# EAGLE design tick-mini-mk-1.0 (EAGLE 6.5.0)
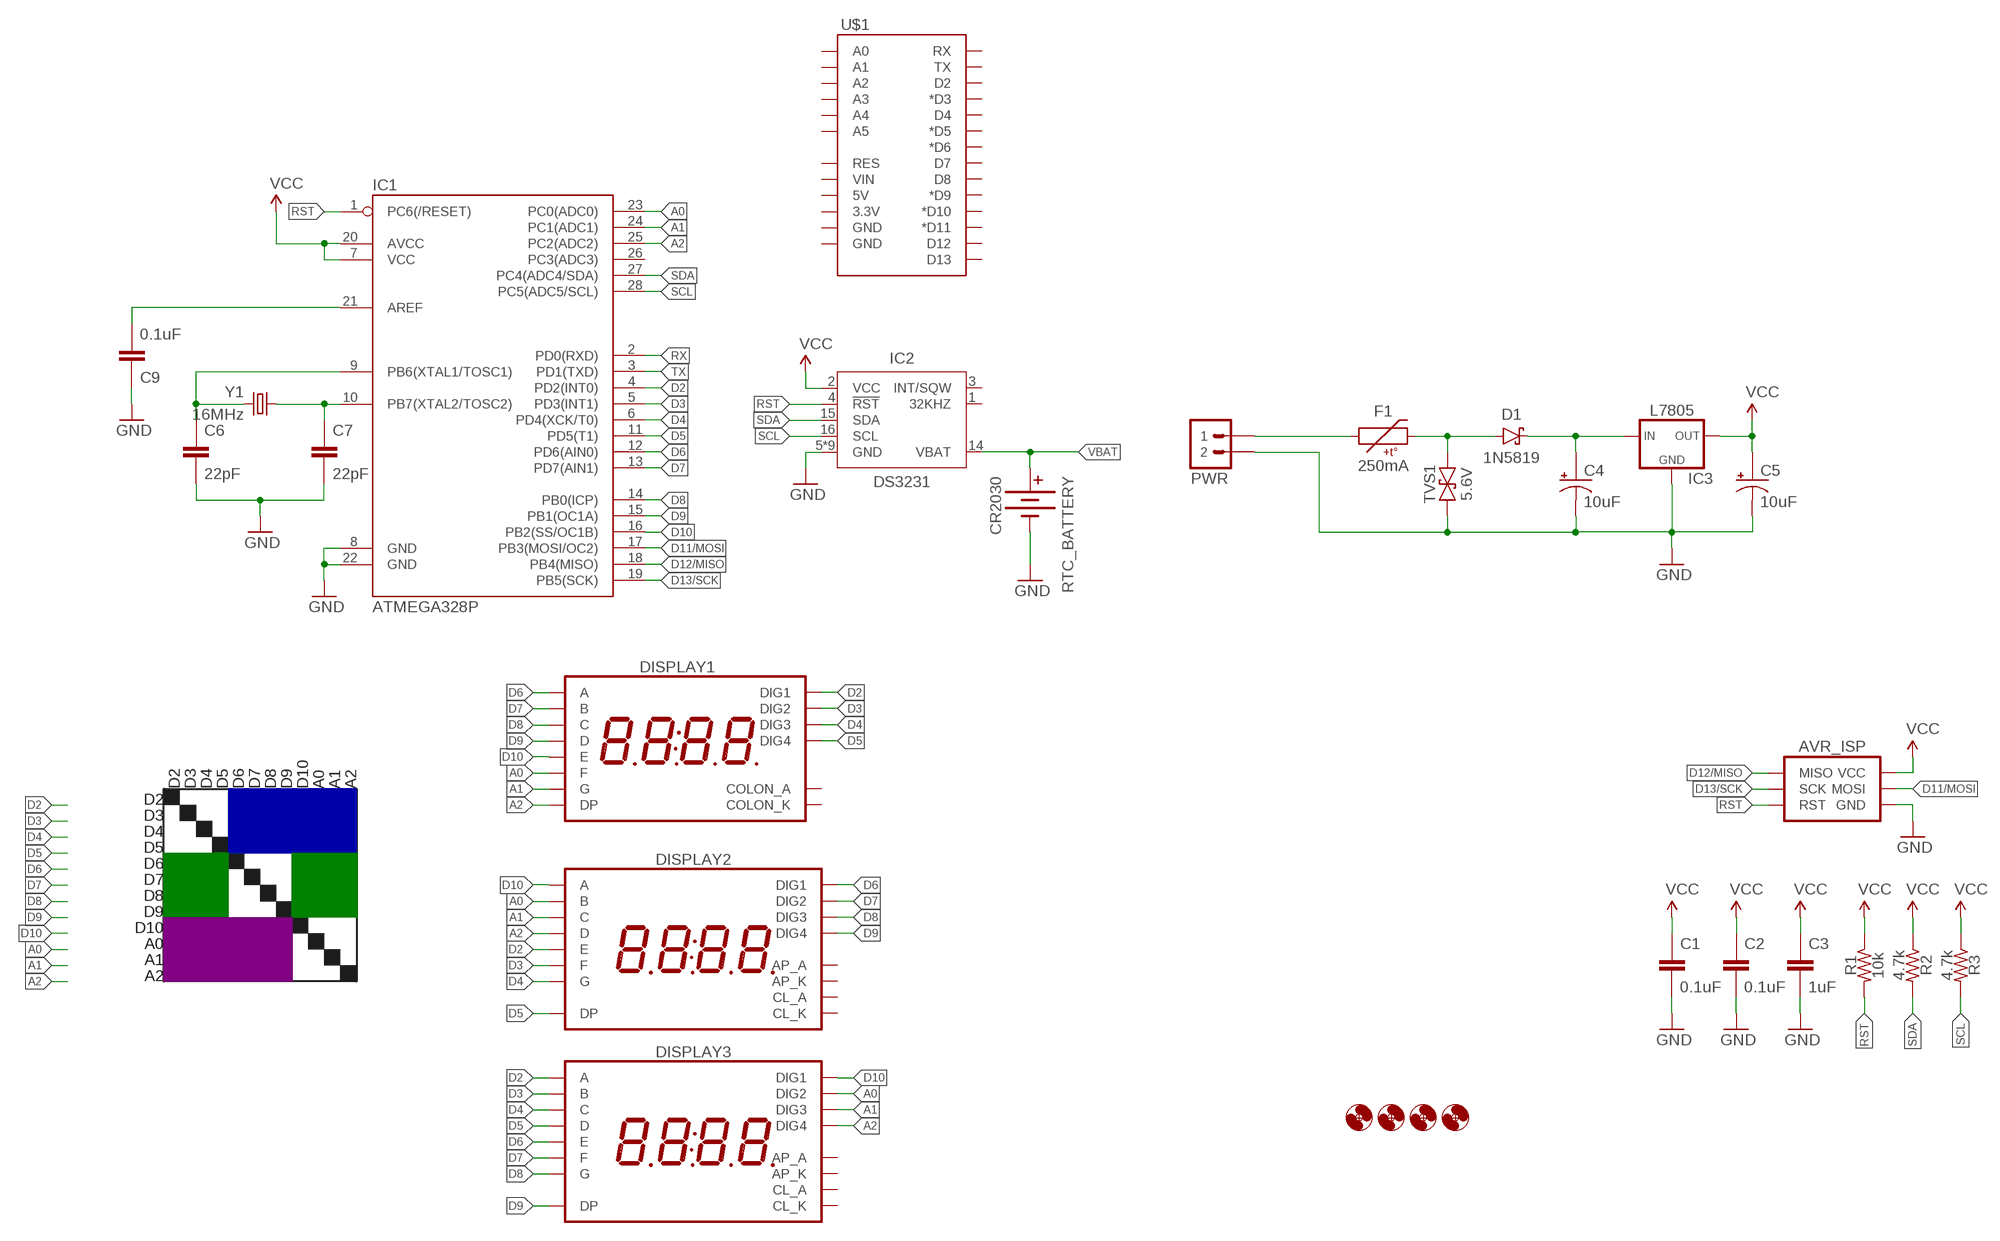
[diagram p0: schematic, sheet 1]

## Parts
AVR_ISP  AVR_SPI_PRG_6PTH  [2X3]
C1  0.1uF  CAPACITOR-CERAMIC025-024X044  [C025-024X044]
C2  0.1uF  CAPACITOR-CERAMIC025-024X044  [C025-024X044]
C3  1uF  CAPACITOR-CERAMIC025-024X044  [C025-024X044]
C4  10uF  CAPACITOR-POLARIZEDE2-5  [E2-5]
C5  10uF  CAPACITOR-POLARIZEDE2-5  [E2-5]
C6  22pF  CAPACITOR-CERAMIC025-024X044  [C025-024X044]
C7  22pF  CAPACITOR-CERAMIC025-024X044  [C025-024X044]
C9  0.1uF  CAPACITOR-CERAMIC025-024X044  [C025-024X044]
D1  1N5819  DIODE-SCHOTTKYPTH-10.16MM  [DIODE-10.16MM]
DISPLAY1  7SEG_4DIGIT_COLON14.2MM-CC  [7SEG_4DIG_0.56IN_14MM_ADAFRUIT]
DISPLAY2  7SEG_4DIGIT_COLON_APOS  [7SEG_4DIG_10MM]
DISPLAY3  7SEG_4DIGIT_COLON_APOS  [7SEG_4DIG_10MM]
F1  250mA  PTCPTH-5.08MM  [PTC-PTH-5.08MM]
H1  HOLE#2  [HOLE-#2]
H2  HOLE#2  [HOLE-#2]
H3  HOLE#2  [HOLE-#2]
H4  HOLE#2  [HOLE-#2]
IC1  ATMEGA328P  ATMEGA328P_PDIP  [DIL28-3]
IC2  DS3231  [SO16W]
IC3  L7805  V_REG_78XXTO-92-INLINE  [TO-92-AMMO]
PWR  M02JST-PTH-VERT  [JST-2-PH-VERT-PTH]
R1  10k  RESISTORPTH-AXIAL-7.62MM  [RESISTOR-AXIAL-PTH-7.62MM]
R2  4.7k  RESISTORPTH-AXIAL-6.35MM  [RESISTOR-AXIAL-PTH-6.35MM]
R3  4.7k  RESISTORPTH-AXIAL-6.35MM  [RESISTOR-AXIAL-PTH-6.35MM]
RTC_BATTERY  CR2030  BATTERY12MM  [BATTCON_12MM]
TVS1  5.6V  TVSDO-41-10.16MM  [DO-41-TVS-BI-10.16MM]
U$1  ARDUINO_SHIELD_SMALLER  [ARDUINO_SHIELD_NOOUTLINE_INSIDE_SMALLER]
Y1  16MHz  CRYSTALHC49UV  [HC49U-V]

## Nets
A0: DISPLAY1.P$12(F) DISPLAY2.16(B) DISPLAY3.2(DIG2) IC1.23(PC0(ADC0))
A1: DISPLAY1.P$5(G) DISPLAY2.13(C) DISPLAY3.6(DIG3) IC1.24(PC1(ADC1))
A2: DISPLAY1.P$3(DP) DISPLAY2.3(D) DISPLAY3.8(DIG4) IC1.25(PC2(ADC2))
D2: DISPLAY1.P$14(DIG1) DISPLAY2.5(E) DISPLAY3.14(A) IC1.4(PD2(INT0))
D3: DISPLAY1.P$11(DIG2) DISPLAY2.11(F) DISPLAY3.16(B) IC1.5(PD3(INT1))
D4: DISPLAY1.P$10(DIG3) DISPLAY2.15(G) DISPLAY3.13(C) IC1.6(PD4(XCK/T0))
D5: DISPLAY1.P$6(DIG4) DISPLAY2.7(DP) DISPLAY3.3(D) IC1.11(PD5(T1))
D6: DISPLAY1.P$13(A) DISPLAY2.1(DIG1) DISPLAY3.5(E) IC1.12(PD6(AIN0))
D7: DISPLAY1.P$9(B) DISPLAY2.2(DIG2) DISPLAY3.11(F) IC1.13(PD7(AIN1))
D8: DISPLAY1.P$4(C) DISPLAY2.6(DIG3) DISPLAY3.15(G) IC1.14(PB0(ICP))
D9: DISPLAY1.P$2(D) DISPLAY2.8(DIG4) DISPLAY3.7(DP) IC1.15(PB1(OC1A))
D10: DISPLAY1.P$1(E) DISPLAY2.14(A) DISPLAY3.1(DIG1) IC1.16(PB2(SS/OC1B))
D11/MOSI: AVR_ISP.4(MOSI) IC1.17(PB3(MOSI/OC2))
D12/MISO: AVR_ISP.1(MISO) IC1.18(PB4(MISO))
D13/SCK: AVR_ISP.3(SCK) IC1.19(PB5(SCK))
GND: AVR_ISP.6(GND) C1.2 C2.2 C3.2 C4.- C5.- C6.2 C7.2 C9.1 IC1.8(GND) IC1.22(GND) IC2.5(GND) IC2.6(GND) IC2.7(GND) IC2.8(GND) IC2.9(GND) IC2.10(GND) IC2.11(GND) IC2.12(GND) IC2.13(GND) IC3.2(GND) PWR.2 RTC_BATTERY.GND(-) TVS1.P$1
N$1: C9.2 IC1.21(AREF)
N$4: D1.A F1.P$2 TVS1.P$2
N$6: C6.1 IC1.9(PB6(XTAL1/TOSC1)) Y1.2
N$7: F1.P$1 PWR.1
N$8: C4.+ D1.C IC3.1(IN)
N$9: C7.1 IC1.10(PB7(XTAL2/TOSC2)) Y1.1
RST: AVR_ISP.5(RST) IC1.1(PC6(/RESET)) IC2.4(!RST) R1.P$2
RX: IC1.2(PD0(RXD))
SCL: IC1.28(PC5(ADC5/SCL)) IC2.16(SCL) R3.P$2
SDA: IC1.27(PC4(ADC4/SDA)) IC2.15(SDA) R2.P$2
TX: IC1.3(PD1(TXD))
VBAT: IC2.14(VBAT) RTC_BATTERY.PWR@1(+)
VCC: AVR_ISP.2(VCC) C1.1 C2.1 C3.1 C5.+ IC1.7(VCC) IC1.20(AVCC) IC2.2(VCC) IC3.3(OUT) R1.P$1 R2.P$1 R3.P$1
Unconnected: DISPLAY1.P$7(COLON_K) DISPLAY1.P$8(COLON_A) DISPLAY2.4(CL_A) DISPLAY2.9(AP_K) DISPLAY2.10(AP_A) DISPLAY2.12(CL_K) DISPLAY3.4(CL_A) DISPLAY3.9(AP_K) DISPLAY3.10(AP_A) DISPLAY3.12(CL_K) IC1.26(PC3(ADC3)) IC2.1(32KHZ) IC2.3(INT/SQW) U$1.3.3V U$1.5V U$1.A0 U$1.A1 U$1.A2 U$1.A3 U$1.A4 U$1.A5 U$1.D2 U$1.D3(*D3) U$1.D4 U$1.D5(*D5) U$1.D6(*D6) U$1.D7 U$1.D8 U$1.D9(*D9) U$1.D10(*D10) U$1.D11(*D11) U$1.D12 U$1.D13 U$1.GND@0(GND) U$1.GND@1(GND) U$1.RES U$1.RX U$1.TX U$1.VIN

## Notes on the sheet
- D2 | D3 | D4 | D5 | D6 | D7 | D8 | D9 | D10 | A0 | A1 | A2
- D2
- D3
- D4
- D5
- D6
- D7
- D8
- D9
- D10
- A0
- A1
- A2

## Library data of the parts
AVR_ISP = A_butts:AVR_SPI_PRG_6: AVR ISP 6 Pin This is the reduced ISP connector for AVR programming. Common on Arduino. This footprint will take up less PCB space and can be used with a 10-pin to 6-pin adapter such as SKU: BOB-08508 **Special note about "TEST_POINT" package. The stop mask is on the top side, so if you want your programming test points to be on the bottom of your board, make sure to place this package on the bottom side of the board. This also ensure that the orientation to program from the bottom side will be correct.
C1-C3 C6 C7 C9 = A_butts:CAPACITOR-CERAMIC: CAPACITOR, European symbol
C4 C5 = A_butts:CAPACITOR-POLARIZED: POLARIZED CAPACITOR, American symbol
D1 = A_butts:DIODE-SCHOTTKY: Schottky diodes in SFE's production catalog BAT20J 1A 23V 0.62Vf RB751 120mA 40V 0.37Vf PMEG4005EJ 0.5A 40V 0.42Vf MBRA140 1A 40V 0.5Vf B340A 3A 40V SMA
DISPLAY1 = A_butts:7SEG_4DIGIT_COLON
DISPLAY2 DISPLAY3 = A_butts:7SEG_4DIGIT_COLON_APOS
F1 = A_butts:PTC: Resettable Fuse PTC Resettable Fuse. Spark Fun Electronics SKU : COM-08357
H1-H4 = A_butts:HOLE: MOUNTING HOLE with drill center marker
IC1 = A_butts:ATMEGA328P_PDIP: uC used in the Arduino 32kb flash, 1k EEPROM, 2k SRAM This is the through-hole version of this chip.
IC2 = A_butts:DS3231
IC3 = A_butts:V_REG_78XX: Voltage Regulator Standard 7805 5V regulator. IGO (Input Ground Output). Spark Fun Electronics SKU : COM-00107
PWR = A_butts:M02: Standard 2-pin 0.1" header. Use with - straight break away headers ( PRT-00116) - right angle break away headers (PRT-00553) - swiss pins (PRT-00743) - machine pins (PRT-00117) - female headers (PRT-00115) Molex polarized connector foot print use with: PRT-08233 with associated crimp pins and housings. 2.54_SCREWTERM for use with PRT-10571. 3.5mm Screw Terminal footprints for PRT-08084 5mm Screw Terminal footprints for use with PRT-08433
R1-R3 = A_butts:RESISTOR: RESISTOR, American symbol
RTC_BATTERY = A_butts:BATTERY: Battery Holders Various common sizes : AA, AAA, 20mm coin cell and 12mm coin cell. 20MM_4LEGS, BATT-10373
TVS1 = A_butts:TVS: Transient voltage suppressor- prevents ESD on inputs. Ignore package description- MBRA140 is NOT this type of part!!!
U$1 = A_butts:ARDUINO_SHIELD_SMALLER
Y1 = A_butts:CRYSTAL: Various standard crystals. Proven footprints. Spark Fun Electronics SKU : COM-00534

## Board
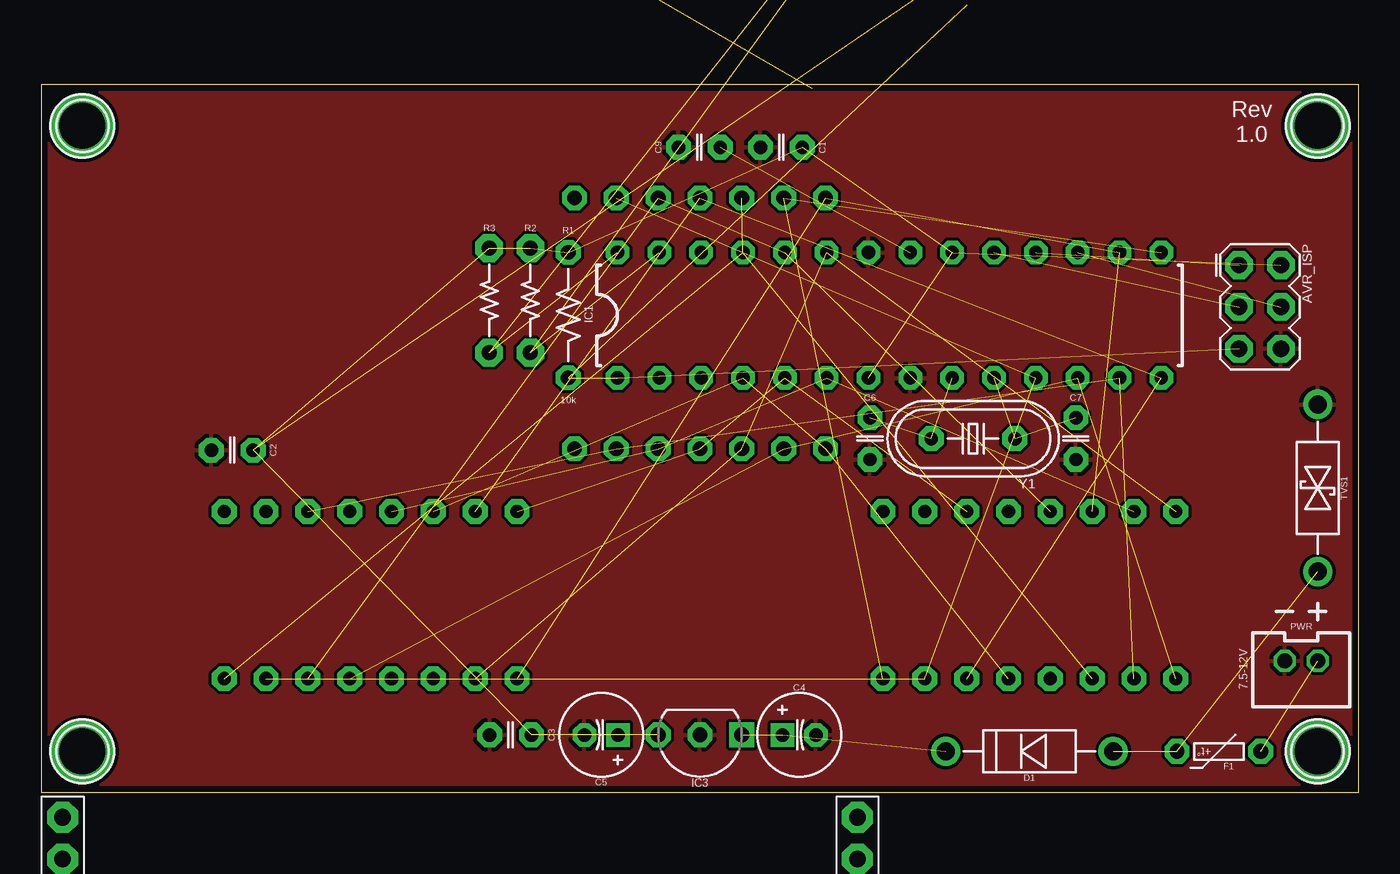
[diagram p1: board, top side]
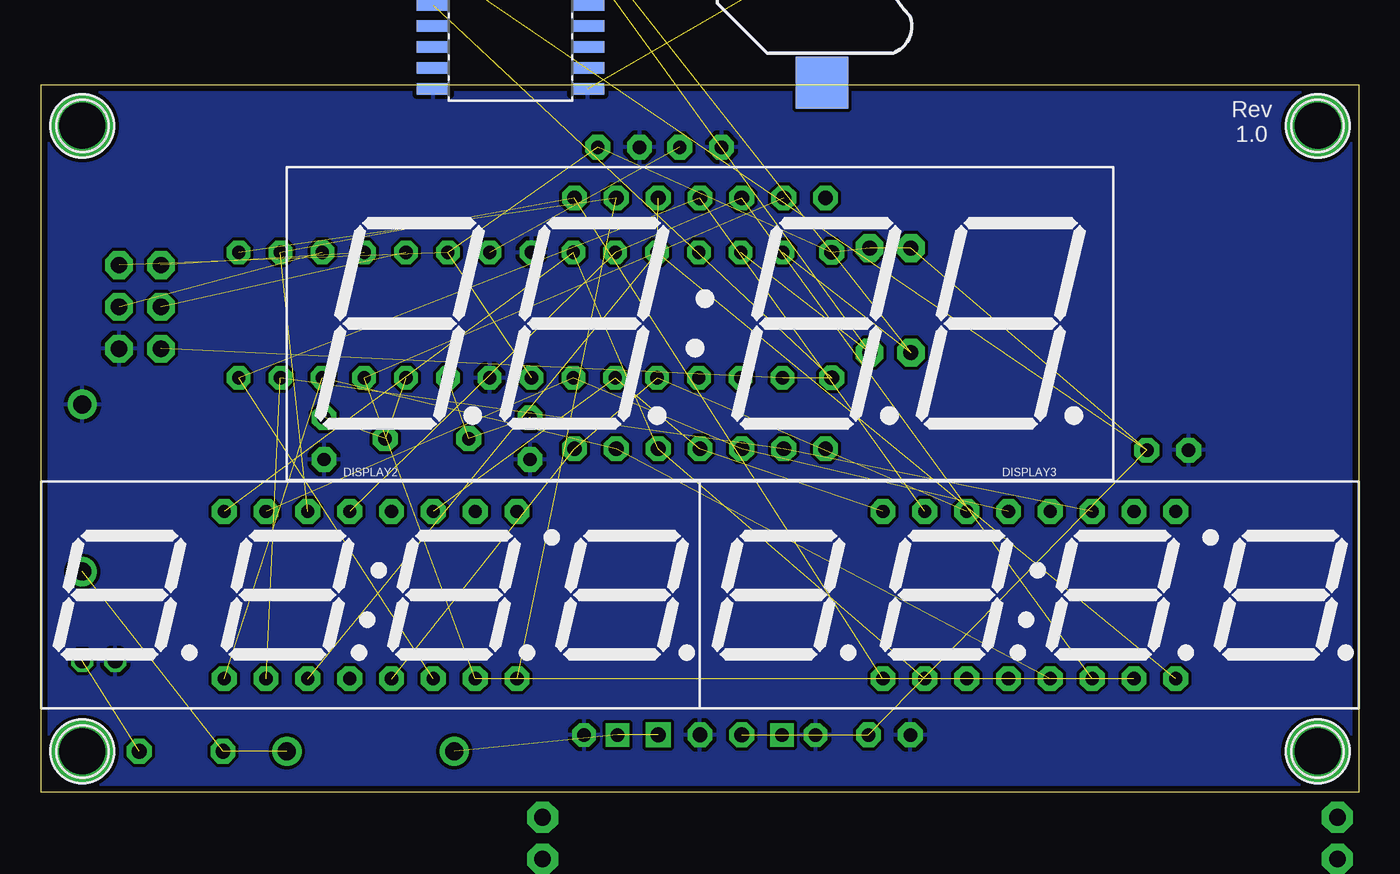
[diagram p2: board, bottom side, seen from below]

Size 80 x 43 mm. Coordinates in mm from the lower left corner, seen from the top.
Outline: 80,0 80,43 0,43 0,0 80,0
Copper layers (1*16): Top 0.0356mm / dielectric 1.5011mm / Bottom 0.0356mm
Design rules "LaenPCBOrder_2": minimum track width 6mil, minimum drill 13mil, track to track 6mil, track to pad 6mil, pad to pad 6mil, via to via 6mil, smd to smd 6mil, copper to edge 15mil, drill to drill 6mil, minimum pad ring 7mil, minimum via ring 7mil, stop-mask expansion 3mil, vias tented up to drill 20mil, thermal gap 10mil

### Footprints (pad centres in the part's own frame; a part is rotated, then mirrored left to right if it is on the bottom)
2X3 = drill 1 pad 1.676 octagon: 1 -2.54,-1.27; 2 -2.54,1.27; 3 0,-1.27; 4 0,1.27; 5 2.54,-1.27; 6 2.54,1.27
C025-024X044 = drill 0.813 pad 1.5 octagon: 1 -1.27,0; 2 1.27,0
E2-5 = drill 0.813 pad 1.422 square: + -1.016,0 | drill 0.813 pad 1.422 octagon: - 1.016,0
DIODE-10.16MM = drill 1.1 pad 1.778: A -5.08,0; C 5.08,0
7SEG_4DIG_0.56IN_14MM_ADAFRUIT = drill 0.9 pad 1.5 octagon: P$1 -7.62,7.62; P$2 -5.08,7.62; P$3 -2.54,7.62; P$4 0,7.62; P$5 2.54,7.62; P$6 5.08,7.62; P$7 7.62,7.62; P$8 7.62,-7.62; P$9 5.08,-7.62; P$10 2.54,-7.62; P$11 0,-7.62; P$12 -2.54,-7.62; P$13 -5.08,-7.62; P$14 -7.62,-7.62
7SEG_4DIG_10MM = drill 0.8 pad 1.5 octagon: 1 -8.89,-5.08; 2 -6.35,-5.08; 3 -3.81,-5.08; 4 -1.27,-5.08; 5 1.27,-5.08; 6 3.81,-5.08; 7 6.35,-5.08; 8 8.89,-5.08; 9 8.89,5.08; 10 6.35,5.08; 11 3.81,5.08; 12 1.27,5.08; 13 -1.27,5.08; 14 -3.81,5.08; 15 -6.35,5.08; 16 -8.89,5.08
PTC-PTH-5.08MM = drill 0.9 pad 1.5 octagon: P$1 -2.54,0; P$2 2.54,0
HOLE-#2 = drill 2.8 pad 3.81: P$1 0,0
DIL28-3 = drill 0.8 pad 1.422 octagon: 1 -16.51,-3.81; 2 -13.97,-3.81; 3 -11.43,-3.81; 4 -8.89,-3.81; 5 -6.35,-3.81; 6 -3.81,-3.81; 7 -1.27,-3.81; 8 1.27,-3.81; 9 3.81,-3.81; 10 6.35,-3.81; 11 8.89,-3.81; 12 11.43,-3.81; 13 13.97,-3.81; 14 16.51,-3.81; 15 16.51,3.81; 16 13.97,3.81; 17 11.43,3.81; 18 8.89,3.81; 19 6.35,3.81; 20 3.81,3.81; 21 1.27,3.81; 22 -1.27,3.81; 23 -3.81,3.81; 24 -6.35,3.81; 25 -8.89,3.81; 26 -11.43,3.81; 27 -13.97,3.81; 28 -16.51,3.81
SO16W = smd 0.7 x 2: 1 -4.445,-4.685; 2 -3.175,-4.685; 3 -1.905,-4.685; 4 -0.635,-4.685; 5 0.635,-4.685; 6 1.905,-4.685; 7 3.175,-4.685; 8 4.445,-4.685; 9 4.445,4.685; 10 3.175,4.685; 11 1.905,4.685; 12 0.635,4.685; 13 -0.635,4.685; 14 -1.905,4.685; 15 -3.175,4.685; 16 -4.445,4.685
TO-92-AMMO = drill 0.9 pad 1.5 square: 1 -2.54,0 | drill 0.9 pad 1.5 octagon: 2 0,0; 3 2.54,0
JST-2-PH-VERT-PTH = drill 0.9 octagon: 1 -1,0; 2 1,0
RESISTOR-AXIAL-PTH-7.62MM = drill 0.9 pad 1.5 octagon: P$1 -3.81,0; P$2 3.81,0
RESISTOR-AXIAL-PTH-6.35MM = drill 0.9 pad 1.676 octagon: P$1 -3.175,0; P$2 3.175,0
BATTCON_12MM = smd 3.962 x 3.962: GND 0,0 | smd 3.175 x 3.175: PWR@1 -7.874,0; PWR@2 7.874,0
DO-41-TVS-BI-10.16MM = drill 1.1 pad 1.778: P$1 -5.08,0; P$2 5.08,0
ARDUINO_SHIELD_NOOUTLINE_INSIDE_SMALLER = drill 1.016 pad 1.88 octagon: 3.3V 48.26,-27.94; 5V 48.26,-25.4; A0 48.26,-12.7; A1 48.26,-10.16; A2 48.26,-7.62; A3 48.26,-5.08; A4 48.26,-2.54; A5 48.26,0; D2 0,-5.08; D3 0,-7.62; D4 0,-10.16; D5 0,-12.7; D6 0,-15.24; D7 0,-17.78; D8 0,-21.59; D9 0,-24.13; D10 0,-26.67; D11 0,-29.21; D12 0,-31.75; D13 0,-34.29; GND@0 48.26,-22.86; GND@1 48.26,-20.32; RES 48.26,-30.48; RX 0,0; TX 0,-2.54; VIN 48.26,-17.78
HC49U-V = drill 0.813 pad 1.524 octagon: 1 -2.54,0; 2 2.54,0

### Placement (x,y rotation side)
AVR_ISP  74,29.5 270 top
C1  44.94,39.2 180 top
C2  11.6,20.8 180 top
C3  28.5,3.5 180 top
C4  46.02,3.5 0 top
C5  34,3.5 180 top
C6  50.32,21.5 270 top
C7  62.82,21.5 270 top
C9  39.96,39.2 0 top
D1  60,2.5 180 top
DISPLAY1  40,28.5 0 bottom
DISPLAY2  60,12 0 bottom
DISPLAY3  20,12 0 bottom
F1  71.5,2.5 180 top
H1  2.5,2.5 0 top
H2  77.5,2.5 0 top
H3  77.5,40.5 0 top
H4  2.5,40.5 0 top
IC1  51.5,29 0 top
IC2  51.5,47.2 270 bottom
IC3  40,3.5 180 top
PWR  76.5,8 180 top
R1  32,29 270 top
R2  29.7,29.9 270 top
R3  27.2,29.9 270 top
RTC_BATTERY  32.6,51 270 bottom
TVS1  77.5,18.5 270 top
U$1  1.3,-1.5 0 top
Y1  56.58,21.5 180 top

### Tracks (layer width: path | path; a pad name or v marks a point on that pad's centre or on a via)
A0  (3 unrouted)
A1  (3 unrouted)
A2  (3 unrouted)
D2  (3 unrouted)
D3  (3 unrouted)
D4  (3 unrouted)
D5  (3 unrouted)
D6  (3 unrouted)
D7  (3 unrouted)
D8  (3 unrouted)
D9  (3 unrouted)
D10  (3 unrouted)
D11/MOSI  (1 unrouted)
D12/MISO  (1 unrouted)
D13/SCK  (1 unrouted)
GND  (1 unrouted)
  pour Top (isolate 0.2): 0,43 80,43 80,0 0,0
  pour Bottom (isolate 0.2): 0,43 80,43 80,0 0,0
N$1  (1 unrouted)
N$4  (2 unrouted)
N$6  (2 unrouted)
N$7  (1 unrouted)
N$8  (2 unrouted)
N$9  (2 unrouted)
RST  (3 unrouted)
SCL  (2 unrouted)
SDA  (2 unrouted)
VBAT  (1 unrouted)
VCC  (11 unrouted)

### Text on the board
tPlace: Rev | 7.5-12V
bPlace: Rev